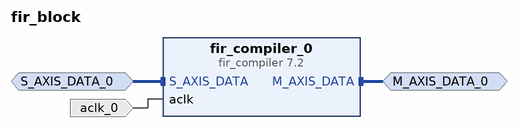
[diagram p0: block diagram of the top level]
# Vivado block design fir_block, xc7z020clg484-1, Vivado 2021.1.1
create_bd_design fir_block

create_bd_intf_port -mode Master -vlnv xilinx.com:interface:axis_rtl:1.0 M_AXIS_DATA_0
create_bd_intf_port -mode Slave -vlnv xilinx.com:interface:axis_rtl:1.0 S_AXIS_DATA_0
set_property -dict [list \
  CONFIG.HAS_TKEEP 0 \
  CONFIG.HAS_TLAST 0 \
  CONFIG.HAS_TREADY 1 \
  CONFIG.HAS_TSTRB 0 \
  CONFIG.LAYERED_METADATA undef \
  CONFIG.TDATA_NUM_BYTES 2 \
  CONFIG.TDEST_WIDTH 0 \
  CONFIG.TID_WIDTH 0 \
  CONFIG.TUSER_WIDTH 0 \
] [get_bd_intf_ports S_AXIS_DATA_0]
create_bd_port -dir I -type clk aclk_0

create_bd_cell -type ip -vlnv xilinx.com:ip:fir_compiler:7.2 fir_compiler_0

# ---- connections ----

connect_bd_intf_net -intf_net S_AXIS_DATA_0_1 [get_bd_intf_ports S_AXIS_DATA_0] [get_bd_intf_pins fir_compiler_0/S_AXIS_DATA]
connect_bd_intf_net [get_bd_intf_ports M_AXIS_DATA_0] [get_bd_intf_pins fir_compiler_0/M_AXIS_DATA]
connect_bd_net -net aclk_0_1 [get_bd_ports aclk_0] [get_bd_pins fir_compiler_0/aclk]

validate_bd_design
save_bd_design
